# Altium schematic sheet TOP.SchDoc
size Letter; CompanyName: UVM AERO; DocumentNumber: 1; Revision: A01; SheetNumber: 1; SheetTotal: 7; DescLong2_DescShort: -
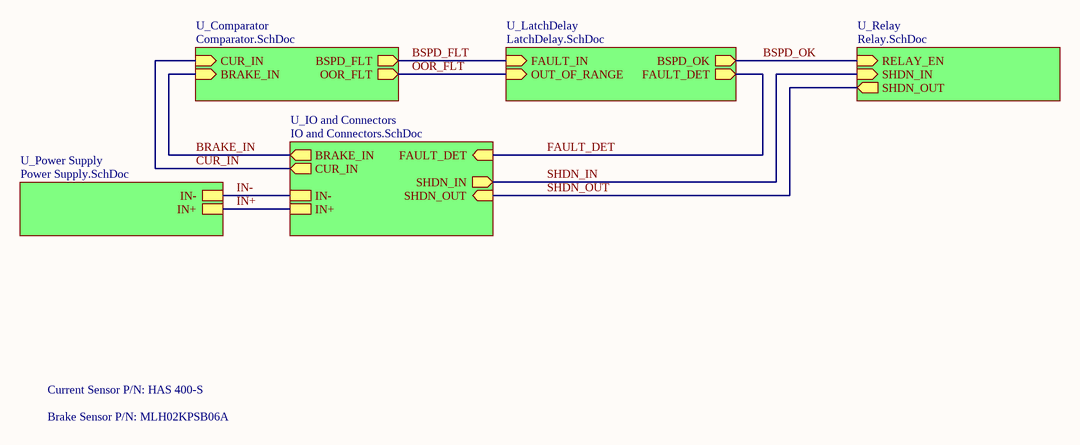
[diagram p0: TOP.SchDoc]

## Sub-sheets
U_Comparator = Comparator.SchDoc: OOR_FLT (out), CUR_IN (in), BSPD_FLT (out), BRAKE_IN (in)
U_IO and Connectors = IO and Connectors.SchDoc: SHDN_OUT (in), SHDN_IN (out), IN+, IN-, FAULT_DET (in), CUR_IN (out), BRAKE_IN (out)
U_LatchDelay = LatchDelay.SchDoc: FAULT_IN (in), FAULT_DET (out), BSPD_OK (out), OUT_OF_RANGE (in)
U_Power Supply = Power Supply.SchDoc: IN-, IN+
U_Relay = Relay.SchDoc: RELAY_EN (in), SHDN_IN (in), SHDN_OUT (out)

## Nets
BRAKE_IN: sheet U_Comparator/BRAKE_IN, sheet U_IO and Connectors/BRAKE_IN
BSPD_FLT: sheet U_Comparator/BSPD_FLT, sheet U_LatchDelay/FAULT_IN
BSPD_OK: sheet U_LatchDelay/BSPD_OK, sheet U_Relay/RELAY_EN
CUR_IN: sheet U_Comparator/CUR_IN, sheet U_IO and Connectors/CUR_IN
FAULT_DET: sheet U_LatchDelay/FAULT_DET, sheet U_IO and Connectors/FAULT_DET
IN+: sheet U_Power Supply/IN+, sheet U_IO and Connectors/IN+
IN-: sheet U_Power Supply/IN-, sheet U_IO and Connectors/IN-
OOR_FLT: sheet U_Comparator/OOR_FLT, sheet U_LatchDelay/OUT_OF_RANGE
SHDN_IN: sheet U_Relay/SHDN_IN, sheet U_IO and Connectors/SHDN_IN
SHDN_OUT: sheet U_Relay/SHDN_OUT, sheet U_IO and Connectors/SHDN_OUT

## Notes on the sheet
- Current Sensor P/N: HAS 400-S
- Brake Sensor P/N: MLH02KPSB06A
- Title:
- Size:
- Date:
- Desc:
- Letter
- Auth:
- Sheet
- Proj:
- of
- www.uvmaero.org
- File: